# EAGLE design power (EAGLE 9.6.2)
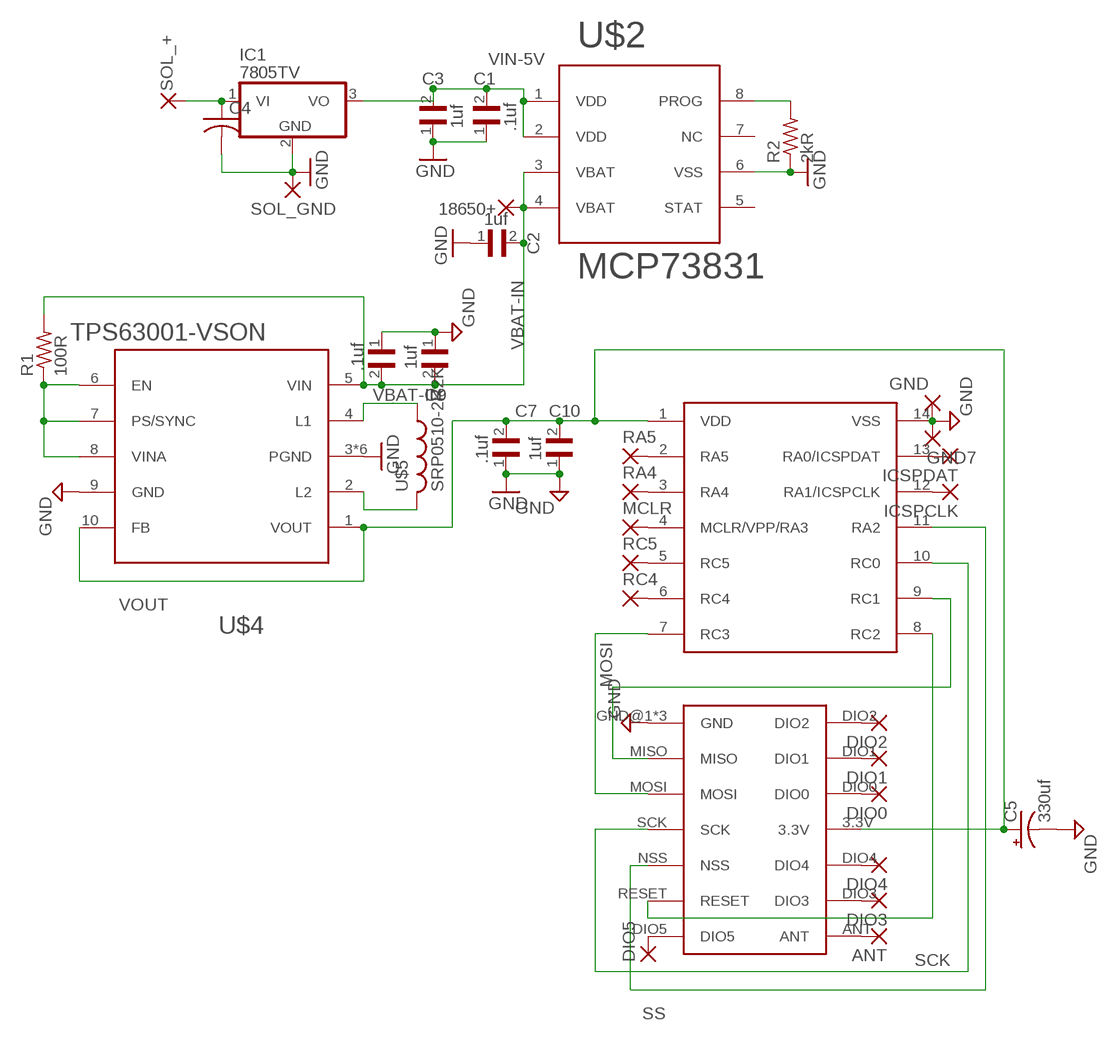
[diagram p0: schematic, sheet 1]

## Parts
18650+  1,6/0,8  [1,6/0,8]
ANT  1,6/0,8  [1,6/0,8]
C1  .1uf  EMF105B7104MVHF  [CAPC1005X55N]
C2  1uf  UMK105CBJ105KV-F  [CAPC1005X70N]
C3  1uf  UMK105CBJ105KV-F  [CAPC1005X70N]
C4  C-USC0402  [C0402]
C5  330uf  CPOL-USE5-10.5  [E5-10,5]
C7  .1uf  EMF105B7104MVHF  [CAPC1005X55N]
C9  1uf  UMK105CBJ105KV-F  [CAPC1005X70N]
C10  1uf  UMK105CBJ105KV-F  [CAPC1005X70N]
DIO0  1,6/0,8  [1,6/0,8]
DIO1  1,6/0,8  [1,6/0,8]
DIO2  1,6/0,8  [1,6/0,8]
DIO3  1,6/0,8  [1,6/0,8]
DIO4  1,6/0,8  [1,6/0,8]
DIO5  1,6/0,8  [1,6/0,8]
GND  1,6/0,8  [1,6/0,8]
GND7  1,6/0,8  [1,6/0,8]
IC1  7805TV  [TO220V]
ICSPCLK  1,6/0,8  [1,6/0,8]
ICSPDAT  1,6/0,8  [1,6/0,8]
MCLR  1,6/0,8  [1,6/0,8]
R1  100R  R-US_R0805  [R0805]
R2  2kR  R-US_0204/7  [0204/7]
RA4  1,6/0,8  [1,6/0,8]
RA5  1,6/0,8  [1,6/0,8]
RC4  1,6/0,8  [1,6/0,8]
RC5  1,6/0,8  [1,6/0,8]
SOL_+  1,6/0,8  [1,6/0,8]
SOL_GND  1,6/0,8  [1,6/0,8]
U$1  PIC16F1615-TSSOP  [PIC16F(L)1615-TSSOP]
U$2  MCP73831  [MCP73831-DFN]
U$3  RFM69HCW  [RFM69HCW]
U$4  TPS63001-VSON  [TPS63001-VSON]
U$5  SRP0510-2R2K  [SRP0510-2R2K]
VBAT-IN  .1uf  EMF105B7104MVHF  [CAPC1005X55N]

## Nets
GND: C1.1 C2.1 C3.1 C4.2 C5.- C7.1 C9.1 C10.1 GND7.1(P) GND.1(P) IC1.2(GND) R2.1 SOL_GND.1(P) U$1.14(VSS) U$2.6(VSS) U$3.GND@1(GND) U$3.GND@2(GND) U$3.GND@3(GND) U$4.3(PGND) U$4.9(GND) U$4.11(PGND) U$4.11@1(PGND) U$4.11@2(PGND) U$4.11@3(PGND) U$4.11@4(PGND) VBAT-IN.1
MOSI: U$1.7(RC3) U$3.MOSI
N$1: U$1.9(RC1) U$3.MISO
N$2: R1.1 U$4.6(EN) U$4.7(PS/SYNC) U$4.8(VINA)
N$3: RA4.1(P) U$1.3(RA4)
N$4: U$1.8(RC2) U$3.RESET
N$5: R2.2 U$2.8(PROG)
N$6: RA5.1(P) U$1.2(RA5)
N$7: RC5.1(P) U$1.5(RC5)
N$8: RC4.1(P) U$1.6(RC4)
N$9: DIO2.1(P) U$3.DIO2
N$12: ICSPCLK.1(P) U$1.12(RA1/ICSPCLK)
N$13: ICSPDAT.1(P) U$1.13(RA0/ICSPDAT)
N$14: MCLR.1(P) U$1.4(MCLR/VPP/RA3)
N$15: DIO1.1(P) U$3.DIO1
N$16: DIO0.1(P) U$3.DIO0
N$17: DIO4.1(P) U$3.DIO4
N$18: DIO3.1(P) U$3.DIO3
N$19: ANT.1(P) U$3.ANT
N$20: DIO5.1(P) U$3.DIO5
N$21: U$4.4(L1) U$5.P$1
N$22: U$4.2(L2) U$5.P$2
SCK: U$1.10(RC0) U$3.SCK
SOL_IN: C4.1 IC1.1(VI) SOL_+.1(P)
SS: U$1.11(RA2) U$3.NSS
VBAT-IN: 18650+.1(P) C2.2 C9.2 R1.2 U$2.3(VBAT) U$2.4(VBAT) U$4.5(VIN) VBAT-IN.2
VIN-5V: C1.2 C3.2 IC1.3(VO) U$2.1(VDD) U$2.2(VDD)
VOUT: C5.+ C7.2 C10.2 U$1.1(VDD) U$3.3.3V U$4.1(VOUT) U$4.10(FB)
Unconnected: U$2.5(STAT) U$2.7(NC)

## Library data of the parts
18650+ ANT DIO0 DIO1-DIO5 GND GND7 ICSPCLK ICSPDAT MCLR RA4 RA5 RC4 RC5 SOL_+ SOL_GND = wirepad:1,6/0,8: THROUGH-HOLE PAD
C1 C7 VBAT-IN = EMF105B7104MVHF:EMF105B7104MVHF; AVAILABILITY: Unavailable; DESCRIPTION: 0.1µF ±20% 16V Ceramic Capacitor X7R 0402 (1005 Metric); MF: Taiyo Yuden; MP: EMF105B7104MVHF; PACKAGE: 1005 Taiyo Yuden; PRICE: None
C2 C3 C9 C10 = UMK105CBJ105KV-F:UMK105CBJ105KV-F: CAP ,MLCC ,0402,50V ,X5R,1.0UF10% ,T&R; AVAILABILITY: Unavailable; DESCRIPTION: 1µF ±10% 50V Ceramic Capacitor X5R 0402 (1005 Metric); MF: Taiyo Yuden; MP: UMK105CBJ105KV-F; PACKAGE: 1005 Taiyo Yuden; PRICE: None
C4 = rcl:C-US: CAPACITOR, American symbol; SPICEPREFIX: C
C5 = rcl:CPOL-US: POLARIZED CAPACITOR, American symbol; SPICEPREFIX: C
IC1 = linear:78*: Positive VOLTAGE REGULATOR Source: http://cache.national.com/ds/LM/LM78L05.pdf http://www.fairchildsemi.com/ds/LM/LM7805.pdf
R1 R2 = rcl:R-US_: RESISTOR, American symbol; SPICEPREFIX: R
U$1 = PIC16F(L)1615:PIC16F1615-TSSOP
U$2 = MCP73831:MCP73831
U$3 = RFM69C:RFM69HCW
U$4 = TPS63001:TPS63001-VSON
U$5 = SRP0510-2R2K :SRP0510-2R2K

## Board
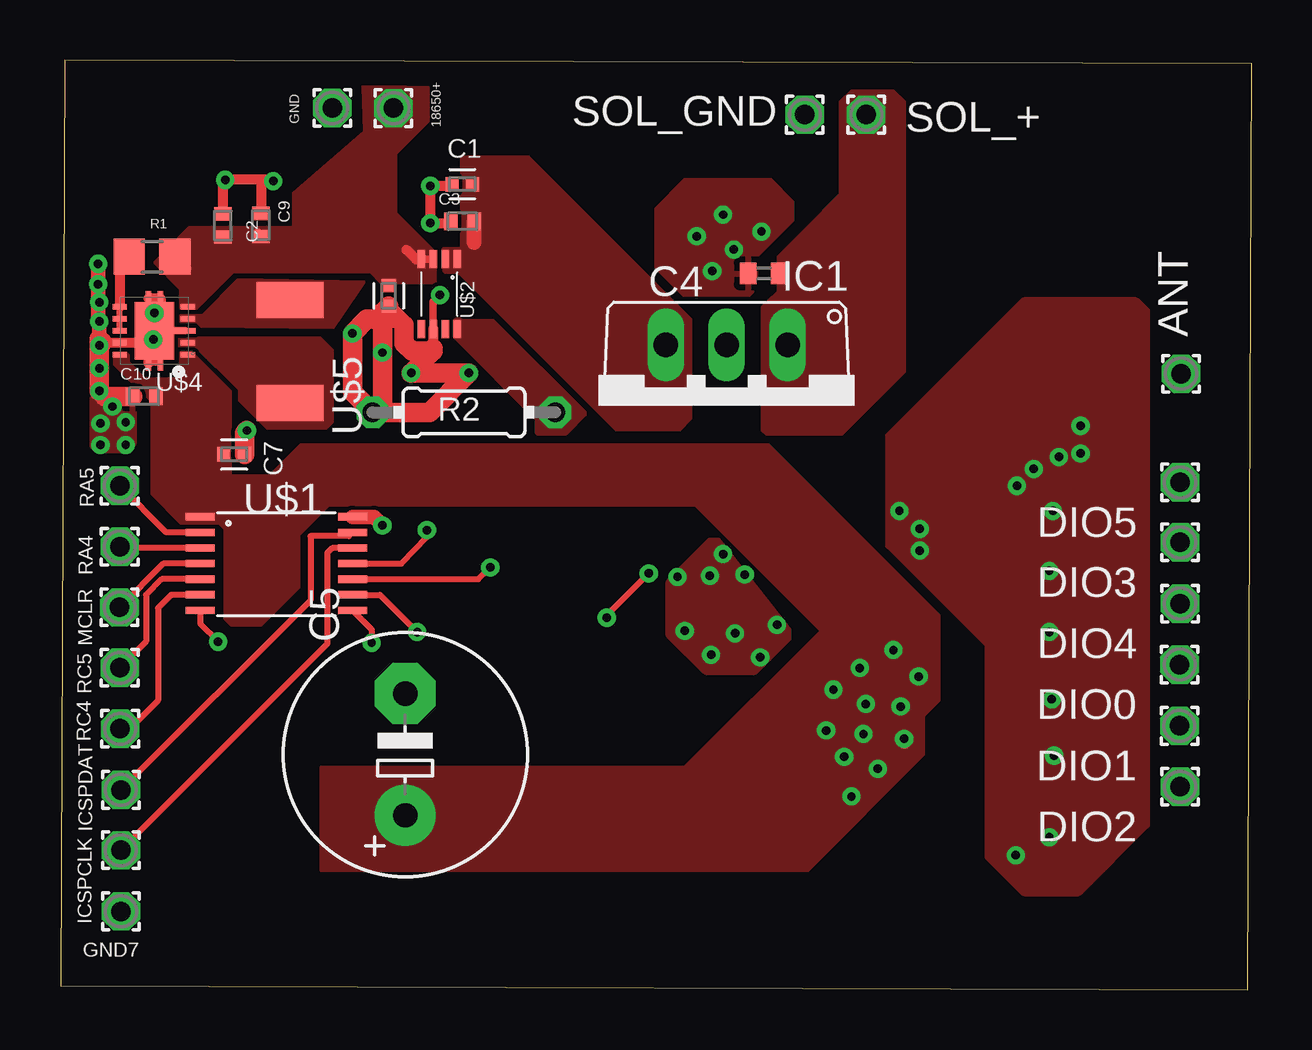
[diagram p1: board, top side]
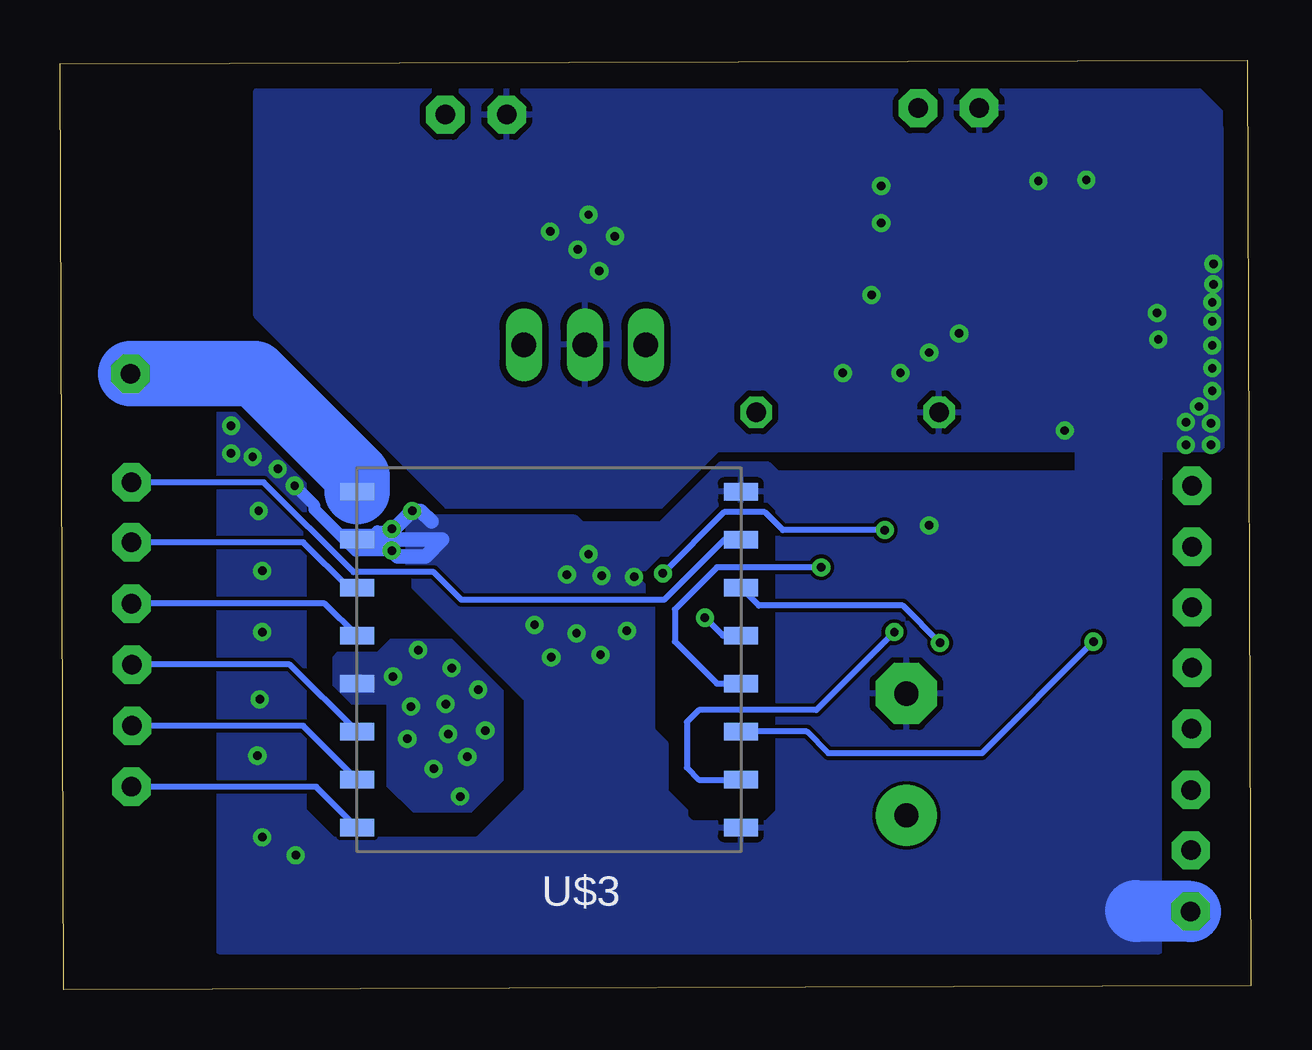
[diagram p2: board, bottom side, seen from below]

Size 49.63 x 38.75 mm. Coordinates in mm from the lower left corner, seen from the top.
Outline: 0,0.15 49.48,0 49.63,38.6 0.15,38.75 0,0.15
Copper layers (1*16): Top 0.035mm / dielectric 1.5mm / Bottom 0.035mm
Design rules "default *": minimum track width 6mil, minimum drill 0.35mm, track to track 6mil, track to pad 6mil, pad to pad 6mil, via to via 6mil, smd to smd 6mil, copper to edge 40mil, drill to drill 6mil, minimum pad ring 10mil, minimum via ring 8mil, stop-mask expansion 4mil, vias tented up to drill 0mil, thermal gap 10mil

### Footprints (pad centres in the part's own frame; a part is rotated, then mirrored left to right if it is on the bottom)
1,6/0,8 = drill 0.813 pad 1.6 octagon: 1 0,0
CAPC1005X55N = smd 0.54 x 0.6: 1 -0.43,0; 2 0.43,0
CAPC1005X70N = smd 0.56 x 0.73: 1 -0.485,0; 2 0.485,0
C0402 = smd 0.7 x 0.9: 1 -0.65,0; 2 0.65,0
E5-10,5 = drill 1.016 pad 2.54: + -2.54,0 | drill 1.016 pad 2.54 octagon: - 2.54,0
TO220V = drill 1.016 long: 1 -2.54,-2.54; 2 0,-2.54; 3 2.54,-2.54
R0805 = smd 1.3 x 1.5: 1 -0.95,0; 2 0.95,0
0204/7 = drill 0.813 octagon: 1 -3.81,0; 2 3.81,0
PIC16F(L)1615-TSSOP = smd 1.2 x 0.3: 1 -3.175,1.975; 2 -3.175,1.325; 3 -3.175,0.675; 4 -3.175,0.025; 5 -3.175,-0.625; 6 -3.175,-1.275; 7 -3.175,-1.925; 8 3.175,-1.925; 9 3.175,-1.275; 10 3.175,-0.625; 11 3.175,0.025; 12 3.175,0.675; 13 3.175,1.325; 14 3.175,1.975
MCP73831-DFN = smd 0.3 x 0.75: 1 -0.75,-1.45; 2 -0.25,-1.45; 3 0.25,-1.45; 4 0.75,-1.45; 5 0.75,1.45; 6 0.25,1.45; 7 -0.25,1.45; 8 -0.75,1.45
RFM69HCW = smd 1.422 x 0.711: 3.3V 8,1; ANT 8,-7; DIO0 8,3; DIO1 8,5; DIO2 8,7; DIO3 8,-3; DIO4 8,-1; DIO5 -8,-5; GND@1 -8,7; GND@2 -8,-7; GND@3 8,-5; MISO -8,5; MOSI -8,3; NSS -8,-1; RESET -8,-3; SCK -8,1
TPS63001-VSON = smd 0.6 x 0.24: 1 -1.4,1; 2 -1.4,0.5; 4 -1.4,-0.5; 5 -1.4,-1; 6 1.45,-1; 7 1.45,-0.5; 8 1.45,0; 9 1.45,0.5; 10 1.45,1 | smd 0.889 x 0.24: 3 -1.273,0 | smd 1.65 x 2.4: 11 0,0 | smd 0.24 x 0.6: 11@1 -0.25,1.35; 11@2 0.25,1.35; 11@3 -0.25,-1.35; 11@4 0.25,-1.35
SRP0510-2R2K = smd 1.5 x 2.8: P$1 2.15,0; P$2 -2.15,0

### Placement (x,y rotation side)
18650+  13.86,36.74 0 top
ANT  46.69,25.67 0 top
C1  16.73,33.57 0 top
C2  6.75,31.85 270 top
C3  16.74,32.02 0 top
C4  29.3,29.85 180 top
C5  14.35,9.8 90 top
C7  7.22,22.31 180 top
C9  8.34,31.87 270 top
C10  3.47,24.73 0 top
DIO0  46.63,13.55 180 top
DIO1  46.62,10.99 180 top
DIO2  46.65,8.45 180 top
DIO3  46.65,18.64 180 top
DIO4  46.65,16.09 180 top
DIO5  46.65,21.14 180 top
GND  11.31,36.75 0 top
GND7  2.5,3.26 0 top
IC1  27.75,24.34 180 top
ICSPCLK  2.49,5.8 0 top
ICSPDAT  2.49,8.32 0 top
MCLR  2.45,15.93 0 top
R1  3.8,30.55 0 top
R2  16.8,24.06 0 top
RA4  2.45,18.46 0 top
RA5  2.45,21 0 top
RC4  2.47,10.87 0 top
RC5  2.45,13.41 0 top
SOL_+  33.57,36.47 0 top
SOL_GND  31.01,36.47 0 top
U$1  8.98,17.73 0 top
U$2  15.77,28.99 180 top
U$3  29.25,13.75 180 bottom
U$4  3.9,27.46 180 top
U$5  9.55,26.6 90 top
VBAT-IN  13.66,28.92 90 top

### Tracks (layer width: path | path; a pad name or v marks a point on that pad's centre or on a via)
GND  (via drill 0.35)
  Top 0.254: U$4.11@1 U$4.11@2
  Top 0.305: U$4.3 U$4.11 | v15.8,28.95 15.52,28.67 U$2.6
  Top 0.406: C1.1 16.23,33.5 v15.4,33.5 v15.4,31.95 16.18,31.95 C3.1 | C9.1 8.34,33.7 v8.85,33.7 8.8,33.75 v6.85,33.75 6.75,33.65 C2.1 | U$4.11 3.4,26.96 U$4.9 1.71,26.96 v1.6,26.85 | U$4.11@2 3.65,27.21 U$4.11 | U$4.11@4 U$4.11@3 4.15,27.71 U$4.11 | U$2.6 15.52,26.62
  Top 0.61: U$1.14 13.04,19.71 v13.4,19.35 | 1.59,27.11 1.6,27.12 v1.6,27.85 1.55,27.9 v1.55,30.25
  Top 0.813: R2.1 15.36,24.06 v17,25.7 v14.6,25.7 15.52,26.62 15.52,26.72 15.4,26.61 14.64,26.61 14.31,26.93 14.31,27.69 13.66,28.34 VBAT-IN.1 | VBAT-IN.1 13.4,28.23 v13.4,26.55 13.4,24.47 R2.1 | VBAT-IN.1 13.66,27.94 12.74,27.94 v12.15,27.35 12.15,24.9 R2.1 | C10.1 1.82,24.73 v1.6,24.95 1.6,26.1 1.59,26.11 1.59,27.11 1.71,26.99 1.71,26.96 | C7.1 7.65,23.2 v7.75,23.3
  Bottom 0.508: 37.76,18.75 U$3.GND@3 | 37.76,18.75 37.98,18.98 | 37.98,18.98 36.52,18.98 36.4,19.1 35.8,19.1 | 37.98,18.98 39.02,20.02 39.02,20.17 v39.85,21 | 37.76,18.75 37.3,18.3 v35.8,18.3
  Bottom 0.61: 34.15,19.5 34.6,19.95 v34.95,19.95 35.8,19.1 v35.8,18.3 35.55,18.05 34.4,18.05 33.7,18.75 U$3.GND@3
  Bottom 2.54: GND7.1 4.76,3.26 4.8,3.3
  other vias: 1.6,25.9 26,14.95 28.1,14.85 25.7,17.2 27.05,17.25 27.15,29.95 26.5,31.4 28.05,30.85 27.6,32.3 29.2,31.6 3.9,28.2 3.85,27.1 41.35,19.95 41.2,17.45 41.2,14.9 41.3,12.1 41.4,9.75 41.2,6.35 39.8,5.6 28.5,17.3 29.85,15.2 27.1,13.95 29.15,13.85 27.6,18.15 1.6,28.65 1.55,29.4 2.7,22.7 1.65,22.7 1.65,23.6 2.7,23.65 2.15,24.3 35.8,19.2 42.5,23.5 42.5,22.35 41.6,22.2 40.55,21.7
  pour Bottom (isolate 0.254): 33.5,20.15 41.45,28.1 41.45,37.45 2.15,37.45 0.45,35.75 0.45,23.4 1.35,22.5 22.25,22.5 24.6,20.15
  pour Bottom: 3.8,23.15 3.8,21.3 4.35,20.75 7.2,20.75 7.2,23.15
  pour Bottom: 3.8,21.5 19.7,21.5 19.7,7.4 20.85,6.25 38.25,6.25 39.45,7.45 39.45,21.05 42.35,23.95 42.95,23.95 43,24 43,1.6 3.8,1.6
  pour Bottom: 23.75,7.4 23.3,6.95 19.9,6.95 19.2,6.25 19.2,4.65 23.1,4.65 25.95,7.5 25.4,8.05 24.85,8.05 24.2,7.4
  pour Bottom: 23.6,7.3 24.5,8.2 24.5,10.2 25.05,10.75 25.05,16.4 28.2,19.55 35,19.55 35,17.1 30.05,12.15 30.05,8.25 32.15,6.15 24.75,6.15
  pour Top: 29,29.25 28.7,28.95 25.95,28.95 24.8,30.1 24.8,32.55 26,33.75 29.6,33.75 30.5,32.85 30.5,32.05 29,30.55 29,29.35
  pour Top: 40.15,28.65 34.55,23.05 34.55,18.55 38.7,14.4 38.7,5.55 40.15,4.1 42.4,4.1 45.2,6.9 45.2,28.25 44.8,28.65
  pour Top: 27.23,18.62 30.25,14.8 28.85,13.4 26.95,13.4 25.5,14.85 25.5,16.9
  pour Top: 3.05,24.55 3.05,22.75 2.75,22.45 1.5,22.45 1.3,22.65 1.3,24.65 2.95,24.65
  pour Bottom: 19.7,21.5 20.1,21.9 22.1,21.9 24.6,19.4 27.85,19.4 26,17.55 25.95,17.55 25.25,17.55 24.65,18.15 24.3,18.15 22.05,20.4 20.1,20.4 19.75,20.05 19.75,21.45
MOSI  (via drill 0.35)
  Top 0.254: U$1.7 5.8,15.25 v6.55,14.5
  Bottom 0.254: v6.55,14.5 11.2,9.85 17.6,9.85 18.5,10.75 U$3.MOSI
N$1  (via drill 0.35)
  Top 0.254: U$1.9 13.29,16.46 v14.85,14.9
  Bottom 0.254: v14.85,14.9 18.1,11.65 23,11.65 23.5,11.15 23.5,9.25 23,8.75 U$3.MISO
N$2
  Top 0.254: U$4.8 U$4.6 U$4.7
  Top 0.406: R1.1 2.45,30.15 U$4.6
N$3
  Top 0.152: 2.5,18.41 RA4.1
  Top 0.254: U$1.3 2.5,18.41
N$4  (via drill 0.35)
  Top 0.254: U$1.8 12.95,15.01 v12.95,14.45
  Bottom 0.254: v12.95,14.45 14.5,16 20.5,16 U$3.RESET
N$5
  pour Top (no thermals): 19.85,23.2 21.05,23.2 21.85,24 18,27.85 16.7,27.85 16.65,27.9 16.45,27.9 16.4,27.85 16.4,27.25 19.85,23.8
N$6
  Top 0.254: U$1.2 4.39,19.05 RA5.1
N$7
  Top 0.254: U$1.5 4.21,17.11 3.55,16.45 3.55,14.51 RC5.1
N$8
  Top 0.152: 2.87,10.87 RC4.1
  Top 0.254: U$1.6 4.61,16.46 4.05,15.9 4.05,12.05 2.87,10.87
N$9
  Bottom 0.254: U$3.DIO2 38.95,8.45 DIO2.1
N$12
  Top 0.254: U$1.12 11.3,18.41 11.1,18.2 11.1,14.41 ICSPCLK.1
N$13
  Top 0.152: U$1.13 12,18.9
  Top 0.254: 12,18.9 10.4,18.9 10.4,16.23 ICSPDAT.1
N$14
  Top 0.254: U$1.4 4.27,17.75 MCLR.1
N$15
  Bottom 0.254: U$3.DIO1 39.49,10.99 DIO1.1
N$16
  Bottom 0.254: U$3.DIO0 40.05,13.55 DIO0.1
N$17
  Bottom 0.254: U$3.DIO4 38.59,16.09 DIO4.1
N$18
  Bottom 0.254: U$3.DIO3 37.6,16.75 39.49,18.64 DIO3.1
N$19
  Bottom 2.73: U$3.ANT 37.25,21.4 41.52,25.67 ANT.1
N$20
  Bottom 0.254: U$3.DIO5 21.94,18.75 24.45,16.24 32.89,16.24 34.05,17.4 37.4,17.4 41.14,21.14 DIO5.1
N$21
  pour Top (no thermals): 5,28.1 5.9,28.1 7.4,29.6 12.64,29.5 11.35,27.6 5.85,27.65 5.65,27.85 5,27.85
N$22
  pour Top (no thermals): 4.9,26.85 5.6,26.85 7.45,25 7.45,24.55 8.6,23.4 11.05,23.4 11.3,23.65 11.3,26.65 10.8,27.15 4.9,27.15
SCK  (via drill 0.35)
  Top 0.254: U$1.10 17.41,17.11 v17.9,17.6
  Bottom 0.254: v17.9,17.6 22.25,17.6 24,15.85 24,14.5 22.25,12.75 U$3.SCK
SOL_IN
  pour Top (no thermals): 29.9,30.3 29.9,30.55 31.05,31.7 32.5,33.15 32.5,36 32.5,37 32.95,37.45 34.7,37.45 35.15,37 35.15,25.75 32.55,23.15 29.4,23.15 29.25,23.3 29.25,28.45 29.45,28.65 29.9,29.1 29.9,30.25
SS  (via drill 0.35)
  Top 0.254: U$1.11 14.19,17.75 15.25,18.85 v15.25,19.15 | v24.5,17.35 22.75,15.6 v22.75,15.5
  Bottom 0.254: v15.25,19.15 19.5,19.15 20.25,19.9 21.95,19.9 v24.5,17.35 | v22.75,15.5 22,14.75 U$3.NSS
VBAT-IN
  Top 0.305: U$2.3 U$2.4
  Top 0.406: U$2.4 14.8,30.44 14.4,30.84 | C9.2 8.21,31.52 | 5.24,30.06 R1.2 5.15,30.15
  pour Top (no thermals): 5,28.4 5.65,28.4 7.17,29.92 12.9,29.92 13.35,29.47 15.6,29.47 15.6,30.72 13.95,32.37 13.95,34.85 15.3,36.2 15.3,37.6 12.6,37.65 12.65,35.75 9.7,33.2 9.7,31.75 5.35,31.75 3.9,30.3 5,29.2
VIN-5V
  Top 0.61: IC1.3 25.2,26.35 | C3.2 17.22,31.14
  pour Top (no thermals): 19.5,34.7 26.25,27.95 26.25,23.8 25.8,23.35 23.14,23.35 16.7,29.78 16.7,34.7
  pour Top (no thermals): 16.7,30.85 15.95,30.85 15.95,30.1 16,30.05 16,29.95 16.55,29.95 16.65,29.85 16.9,30.1 16.9,30.65
VOUT  (via drill 0.35)
  Top 0.61: 35.15,10.35 v35.15,10.45
  Bottom 0.61: 37.15,12.85 U$3.3.3V
  other vias: 32.2,12.5 34.05,9.2 32.95,8.05 31.9,10.8 33.3,13.4 34.7,14.15 32.65,9.7 33.45,10.65 33.55,11.9 35,11.8 35.75,13.05
  pour Top (no thermals): 5,26.55 5.45,26.55 7.05,24.95 7.05,19.75 6.75,19.45 5,19.45 3.8,20.65 3.8,24.5 2.2,26.1 2.2,26.55 2.7,26.55 2.8,26.45 2.8,26.15 3.5,25.45 5,25.45
  pour Top (no thermals): 6.5,19.55 6.85,19.2 6.85,15.45 7.1,15.2 8.35,15.2 9.9,16.75 9.9,18.95 11.15,20.2 26.45,20.2 31.7,14.95 26,9.25 10.85,9.25 10.85,4.98 31.13,4.98 35.95,9.8 35.95,11.4 36.6,12.05 36.6,15.6 29.5,22.7 10,22.7 8.7,21.4 6.5,21.4
  pour Bottom (no thermals): 33.3,14.55 31.2,12.45 31.2,8.75 32.5,7.45 34.9,7.45 35.95,8.5 35.95,11.95 37.45,11.95 38.2,12.7 38.2,13.85 38.05,14 36.4,14 35.85,14.55